# EAGLE design Blinky (EAGLE 6.6.0)
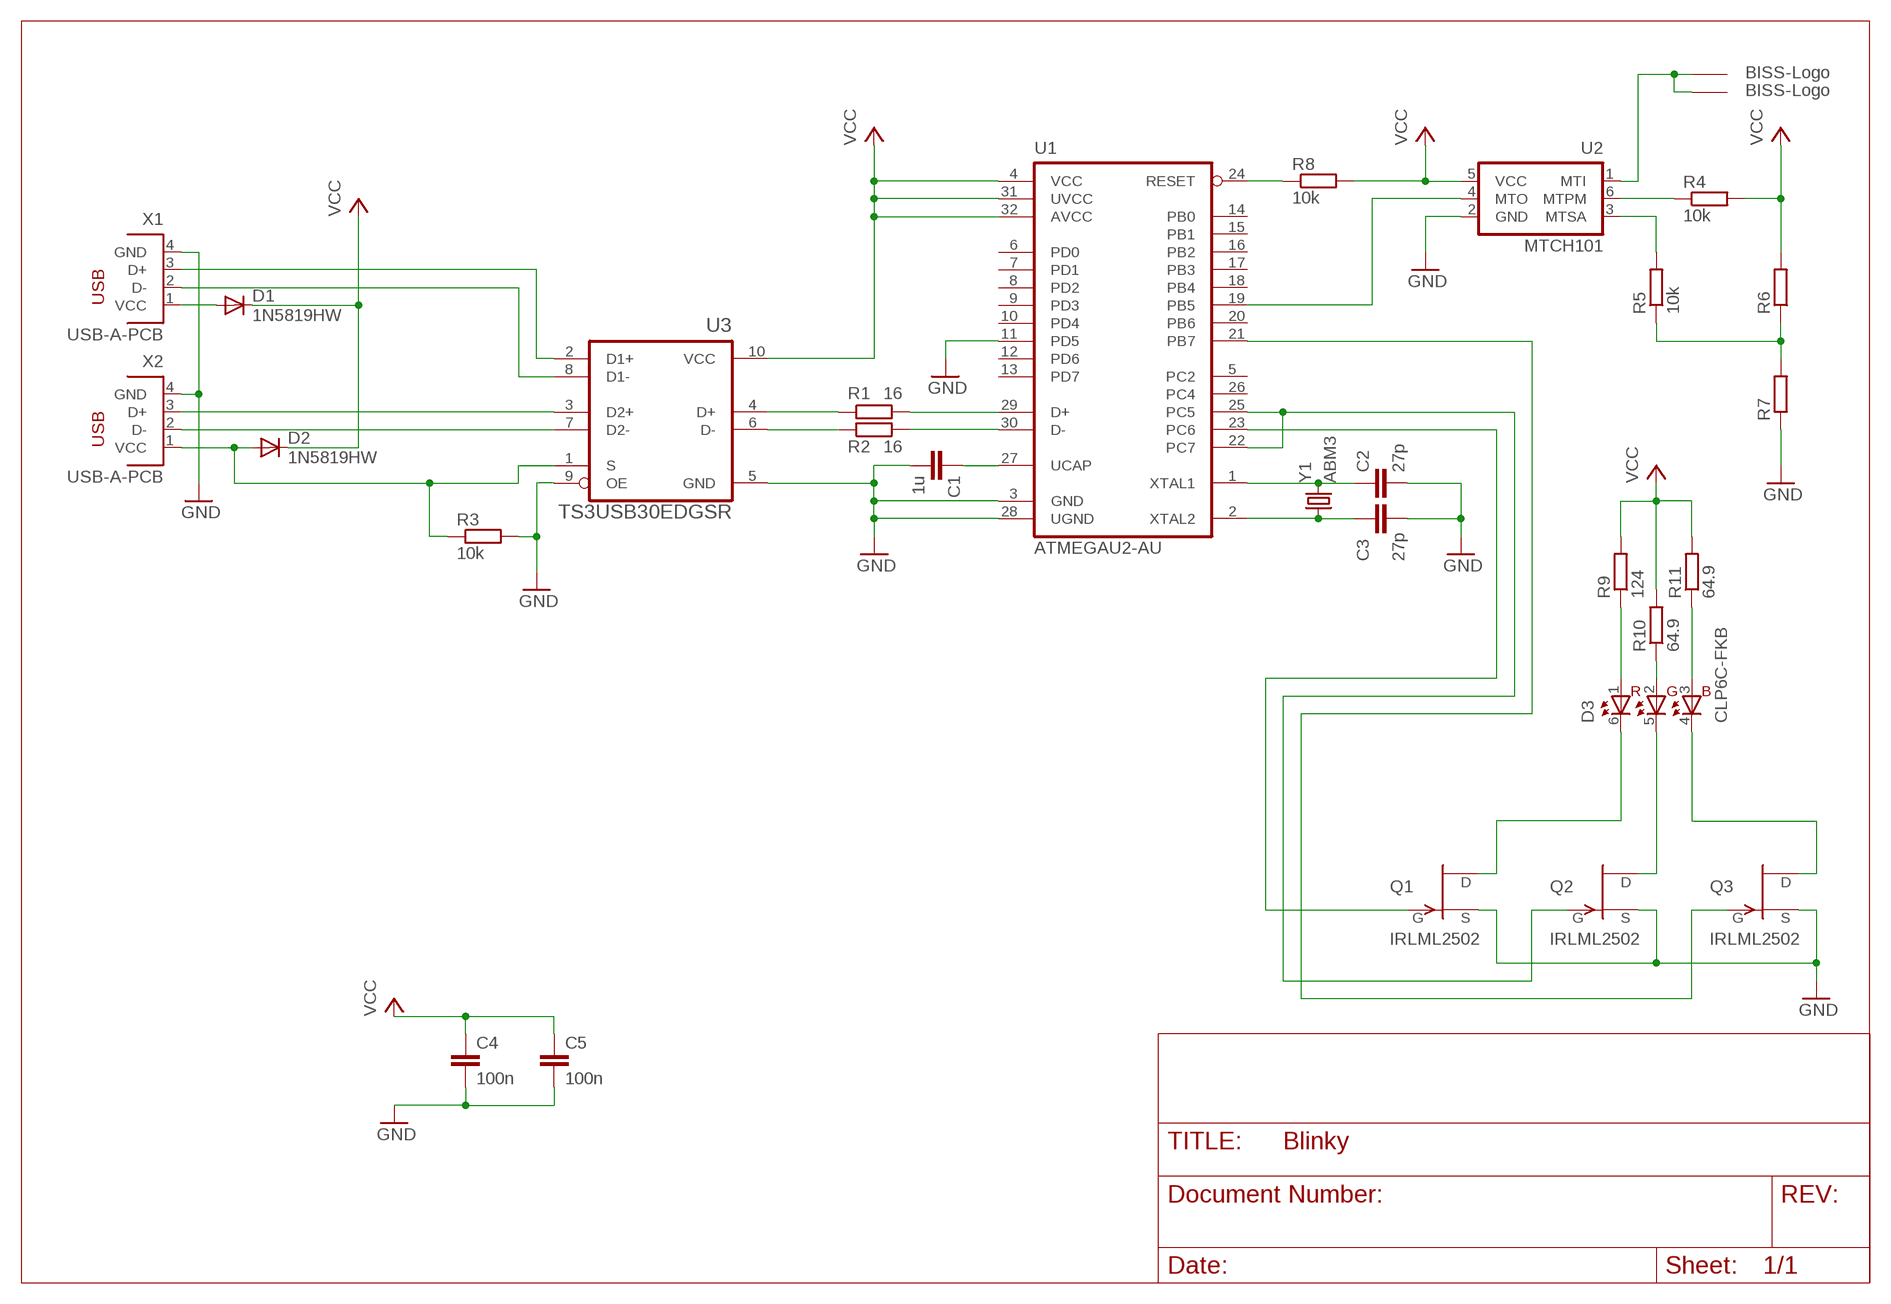
[diagram p0: schematic, sheet 1]

## Parts
C1  1u  C-EUC0805  [C0805]
C2  27p  C-EUC0805  [C0805]
C3  27p  C-EUC0805  [C0805]
C4  100n  C-EUC0805  [C0805]
C5  100n  C-EUC0805  [C0805]
D1  1N5819HW  DIODE-SOD123  [SOD123]
D2  1N5819HW  DIODE-SOD123  [SOD123]
D3  CLP6C-FKB  [PLCC-6]
Q1  IRLML2502  [SOT23]
Q2  IRLML2502  [SOT23]
Q3  IRLML2502  [SOT23]
R1  16  R-EU_R0805  [R0805]
R2  16  R-EU_R0805  [R0805]
R3  10k  R-EU_R0805  [R0805]
R4  10k  R-EU_R0805  [R0805]
R5  10k  R-EU_R0805  [R0805]
R6  R-EU_R0805  [R0805]
R7  R-EU_R0805  [R0805]
R8  10k  R-EU_R0805  [R0805]
R9  124  R-EU_R0805  [R0805]
R10  64.9  R-EU_R0805  [R0805]
R11  64.9  R-EU_R0805  [R0805]
U1  ATMEGAU2-AU  [TQFP32-08]
U2  MTCH101  [SOT23-6]
U3  TS3USB30EDGSR  [VSSOP-10]
U$1  LOGO  [LOGO]
U$2  LOGO  [LOGO]
X1  USB-A-PCB  [USB-A-PCB]
X2  USB-A-PCB  [USB-A-PCB]
Y1  ABM3  [ABM3]

## Nets
D1+: U3.2(D1+) X1.3(D+)
D1-: U3.8(D1-) X1.2(D-)
D2+: U3.3(D2+) X2.3(D+)
D2-: U3.7(D2-) X2.2(D-)
D+_CON: R1.1 U3.4(D+)
D+_MIC: R1.2 U1.29(D+)
D-_CON: R2.1 U3.6(D-)
D-_MIC: R2.2 U1.30(D-)
GND: C1.2 C2.2 C3.2 C4.2 C5.2 Q1.2(S) Q2.2(S) Q3.2(S) R3.2 R7.1 U1.3(GND) U1.11(PD5) U1.28(UGND) U2.2(GND) U3.5(GND) U3.9(OE) X1.4(GND) X2.4(GND)
GND_LED_B: D3.4 Q3.3(D)
GND_LED_G: D3.5 Q2.3(D)
GND_LED_R: D3.6 Q1.3(D)
LED_B: Q3.1(G) U1.21(PB7)
LED_G: Q2.1(G) U1.22(PC7) U1.25(PC5)
LED_R: Q1.1(G) U1.23(PC6)
N$16: R4.1 U2.6(MTPM)
N$18: R5.2 U2.3(MTSA)
N$19: R5.1 R6.1 R7.2
RESET: R8.1 U1.24(RESET)
TOUCH: U1.19(PB5) U2.4(MTO)
TOUCH_PAD: U2.1(MTI) U$1.P$1 U$2.P$1
UCAP: C1.1 U1.27(UCAP)
V_LED_B: D3.3 R11.1
V_LED_G: D3.2 R10.1
V_LED_R: D3.1 R9.1
VCC: C4.1 C5.1 D1.C D2.C R4.2 R6.2 R8.2 R9.2 R10.2 R11.2 U1.4(VCC) U1.31(UVCC) U1.32(AVCC) U2.5(VCC) U3.10(VCC)
VUSB1: D1.A X1.1(VCC)
VUSB2: D2.A R3.1 U3.1(S) X2.1(VCC)
XTAL1: C2.1 U1.1(XTAL1) Y1.2
XTAL2: C3.1 U1.2(XTAL2) Y1.1
Unconnected: U1.5(PC2) U1.6(PD0) U1.7(PD1) U1.8(PD2) U1.9(PD3) U1.10(PD4) U1.12(PD6) U1.13(PD7) U1.14(PB0) U1.15(PB1) U1.16(PB2) U1.17(PB3) U1.18(PB4) U1.20(PB6) U1.26(PC4)

## Library data of the parts
C1-C5 = rcl:C-EU: CAPACITOR, European symbol
D1 D2 = diode:DIODE-: DIODE
D3 = mibe:CLP6C: CLP6C-xxx
Q1-Q3 = mibe:IRLML2502: IRLML2502 HEXFET Power MOSFET These N-Channel MOSFETs from International Rectifier utilize advanced processing techniques to achieve extremely low on-resistance per silicon area. This benefit, combined with the fast switching speed and ruggedized device design that HEXFET power MOSFETs are well known for, provides the designer with an extremely efficient and reliable device for use in battery and load management.
R1-R11 = rcl:R-EU_: RESISTOR, European symbol
U1 = mibe:ATMEGA*U2: ATmega*U2 8-bit Microcontroller with 8/16/32K Bytes of ISP Flash and USB Controller
U2 = mibe:MTCH101: MTCH101 - Single-Channel Proximity Detector The MTCH101 provides an easy way to add proximity or touch detection to any human interface application. The device integrates a single-channel capacitive proximity detection, which can work through plastic, glass or wood-front panel. It also supports a wide range of conductive materials as sensor, like copper pad on PCB, silver or carbon printing on plastic, Indium Tin Oxide (ITO) pad, wire/cable, etc. On-board adjustable sensitivity and power mode selection allow the user to configure the device at run time easily. An active-low output will communicate the state of the sensor to a host/master MCU, or drive an indication LED.
U3 = mibe:TS3USB30E: ESD-Protected, High-Speed USB 2.0 (480-Mbps) 1:2 Multiplexer/Demultiplexer Switch With Single Enable The TS3USB30E is a high-bandwidth 1:2 switch specially designed for the switching of high-speed USB 2.0 signals in handset and consumer applications, such as cell phones, digital cameras, and notebooks with hubs or controllers with limited USB I/Os. The wide bandwidth (900 MHz) of this switch allows signals to pass with minimum edge and phase distortion. The device multiplexes differential outputs from a USB host device to one of two corresponding outputs, or from two different hosts to one corresponding output. The switch is bidirectional and offers little or no attenuation of the high-speed signals at the outputs. It is designed for low bit-to-bit skew and high channel-to-channel noise isolation, and is compatible with various standards, such as high-speed USB 2.0 (480 Mbps).
U$1 U$2 = BISS:LOGO: The BISS logo
X1 X2 = mibe:USB-A-PCB: USB A on PCB connector Thickness of PCB should be at least 2 mm for a good fit. USB 2.0 spec defines 2.235 mm (see figure 6-9 on page 99 in the spec).
Y1 = mibe:ABM3: Miniature Ceramic SMD Crystal

## Board
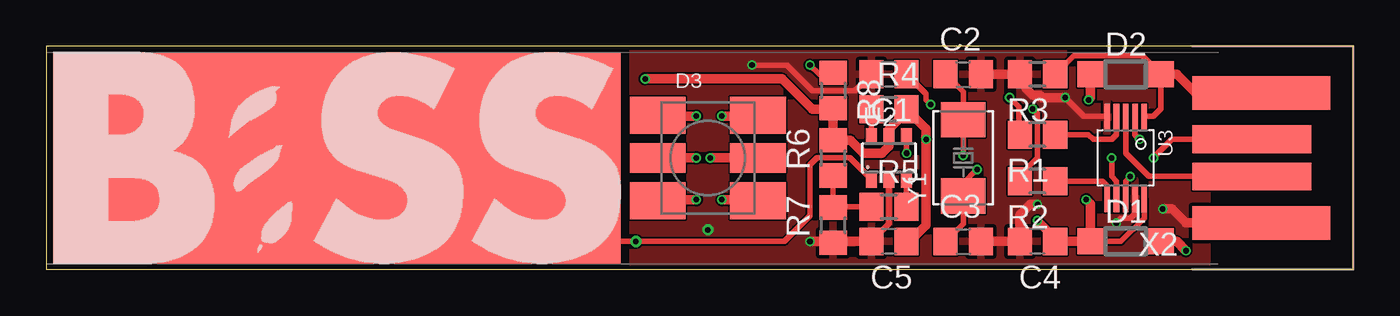
[diagram p1: board, top side]
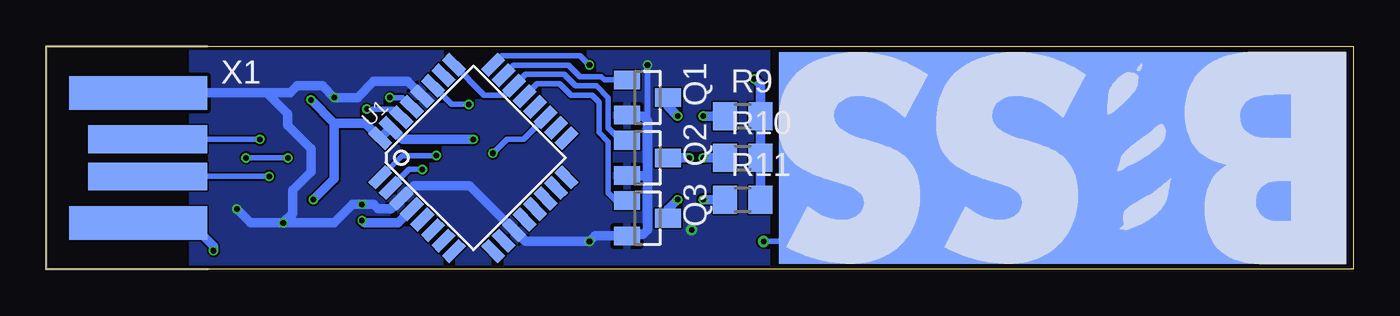
[diagram p2: board, bottom side, seen from below]

Size 70.38 x 12 mm. Coordinates in mm from the lower left corner, seen from the top.
Outline: 0,0 70.38,0 70.38,12 0,12 0,0
Copper layers (1*16): Top 0.018mm / dielectric 1.55mm / Bottom 0.018mm
Design rules "Multi-CB_2L_100µm-Tracks_OL35µm": minimum track width 0.1mm, minimum drill 0.2mm, track to track 0.1mm, track to pad 0.1mm, pad to pad 0.1mm, via to via 0.1mm, smd to smd 0mil, copper to edge 0.2mm, drill to drill 0.2mm, minimum pad ring 0.125mm, minimum via ring 0.1mm, stop-mask expansion 2mil, vias tented up to drill 0.45mm, thermal gap 0.2mm
tRestrict: area 31,9.5 to 31.4,12; area 31,0 to 31.4,1.2; area 31,1.8 to 31.4,2.9
bRestrict: area 31,0 to 31.4,1.2; area 31,1.8 to 31.4,2.9; area 31,9.1 to 31.4,12

### Footprints (pad centres in the part's own frame; a part is rotated, then mirrored left to right if it is on the bottom)
C0805 = smd 1.3 x 1.5: 1 -0.95,0; 2 0.95,0
SOD123 = smd 1.4 x 1.4: A 1.9,0; C -1.9,0
PLCC-6 = smd 3 x 2: 1 -2.7,2.3; 3 -2.7,-2.3; 4 2.7,-2.3; 6 2.7,2.3 | smd 3 x 1.6: 2 -2.7,0; 5 2.7,0
SOT23 = smd 1 x 1.4: 1 -0.95,-1.1; 2 0.95,-1.1; 3 0,1.1
R0805 = smd 1.3 x 1.5: 1 -0.95,0; 2 0.95,0
TQFP32-08 = smd 1.27 x 0.559: 1 -4.293,2.8; 2 -4.293,2; 3 -4.293,1.2; 4 -4.293,0.4; 5 -4.293,-0.4; 6 -4.293,-1.2; 7 -4.293,-2; 8 -4.293,-2.8; 17 4.293,-2.8; 18 4.293,-2; 19 4.293,-1.2; 20 4.293,-0.4; 21 4.293,0.4; 22 4.293,1.2; 23 4.293,2; 24 4.293,2.8 | smd 0.559 x 1.27: 9 -2.8,-4.293; 10 -2,-4.293; 11 -1.2,-4.293; 12 -0.4,-4.293; 13 0.4,-4.293; 14 1.2,-4.293; 15 2,-4.293; 16 2.8,-4.293; 25 2.8,4.293; 26 2,4.293; 27 1.2,4.293; 28 0.4,4.293; 29 -0.4,4.293; 30 -1.2,4.293; 31 -2,4.293; 32 -2.8,4.293
SOT23-6 = smd 0.6 x 0.9: 1 -0.95,-1.15; 2 0,-1.15; 3 0.95,-1.15; 4 0.95,1.15; 5 0,1.15; 6 -0.95,1.15
VSSOP-10 = smd 1.45 x 0.3: 1 -2.2,1; 2 -2.2,0.5; 3 -2.2,0; 4 -2.2,-0.5; 5 -2.2,-1; 6 2.2,-1; 7 2.2,-0.5; 8 2.2,0; 9 2.2,0.5; 10 2.2,1
LOGO = smd 30.558 x 11.4: P$1 15.279,-5.7
USB-A-PCB = smd 7.41 x 1.8: 1 -3.705,-3.5; 4 -3.705,3.5 | smd 6.41 x 1.5: 2 -3.205,-1; 3 -3.205,1
ABM3 = smd 1.9 x 2.4: 1 -2.05,0; 2 2.05,0

### Placement (x,y rotation side)
C1  45.38,10.5 180 top
C2  49.38,10.5 0 top
C3  49.38,1.5 0 top
C4  53.38,1.5 180 top
C5  45.38,1.5 180 top
D1  58.12,1.5 0 top
D2  58.12,10.5 0 top
D3  35.62,6 0 top
Q1  38,9.25 270 bottom
Q2  38,6 270 bottom
Q3  38,2.75 270 bottom
R1  53.38,7.25 180 top
R2  53.38,4.75 180 top
R3  53.38,10.5 180 top
R4  45.38,8.62 0 top
R5  45.38,3.38 0 top
R6  42.38,6 90 top
R7  42.38,2.38 90 top
R8  42.38,9.62 270 top
R9  32.88,8.25 0 bottom
R10  32.88,6 0 bottom
R11  32.88,3.75 0 bottom
U1  47.38,6 45 bottom
U2  45.38,6 0 top
U3  58.12,6 270 top
U$1  0.38,11.7 0 top
U$2  0.38,0.3 180 bottom
X1  61.73,6 0 bottom
X2  61.73,6 180 top
Y1  49.38,6 90 top

### Tracks (layer width: path | path; a pad name or v marks a point on that pad's centre or on a via)
D1+  (via drill 0.3)
  Top 0.3: v58.88,7 58.62,7.25 U3.2
  Bottom 0.3: v58.88,7 X1.3
D1-  (via drill 0.3)
  Top 0.3: v58.38,5 58.12,4.75 U3.8
  Bottom 0.3: X1.2 v58.38,5
D2+
  Top 0.3: X2.3 59.38,5 58.12,6.25 U3.3
D2-  (via drill 0.3)
  Top 0.3: X2.2 60.62,7 v59.62,6 | v57.38,6 57.38,5 57.62,4.75 U3.7
  Bottom 0.3: v59.62,6 v57.38,6
D+_CON
  Top 0.3: U3.4 57.62,7.25 57.38,7 56.38,7 56.12,7.25 R1.1
D+_MIC  (via drill 0.3)
  Top 0.3: 52.38,7.25 52.38,8.75 v51.88,9.25
  Top 0.5: R1.2 52.38,7.25
  Bottom 0.3: v51.88,9.25 51.19,9.25 U1.29
D-_CON
  Top 0.3: R2.1 56.88,4.75 57.12,4.5 U3.6
D-_MIC  (via drill 0.3)
  Top 0.3: R2.2 52.42,5.05 53.38,6 53.38,8.38 v53.12,8.62
  Bottom 0.3: U1.30 51.7,8.62 v53.12,8.62
GND  (via drill 0.3, 0.3 pad 0.6)
  Top 0.3: U3.9 58.62,3 58.38,2.75 57.88,2.75 v57.62,2.5 | U3.5 57.08,8.25 55.88,8.25 v54.88,9.25 | U2.2 45.38,2.45 C5.2 | 42.45,1.5 R7.1 | 50.33,10.55 C2.2 | C1.2 43.55,9.62 41.25,9.62 39.88,11 v38,11
  Top 0.5: v60.12,3.25 60.62,3.25 61.38,2.5 X2.4 | C3.2 C4.2 52.42,2.92 53,3.5 v53.38,3.5 | C2.2 R3.2 52.75,10.18 52.75,9.75 53.12,9.38 53.5,9.38 53.62,9.25 v54.88,9.25 | C5.2 42.45,1.5 | v41.12,1.5 42.3,1.5 R7.1
  Bottom 0.3: v38,11 38,8
  Bottom 0.5: X1.4 58.5,9.5 | 58.5,9.5 57.38,8.38 57.38,7.75 56.12,6.5 56.12,5.25 57.12,4.25 57.12,3 v57.62,2.5 | v57.62,2.5 54.88,2.5 53.88,3.5 v53.38,3.5 52.75,3.5 52.5,3.25 51.82,3.25 U1.3 50.57,4.5 47.57,4.5 U1.11 44.57,1.5 v41.12,1.5 40.83,1.8 Q3.2 39.02,1.88 38.25,1.88 38,2.12 38,5 | v57.62,2.5 59.38,2.5 v60.12,3.25 | 58.5,9.5 57.25,9.5 56.88,9.88 55.5,9.88 v54.88,9.25 53.62,9.25 52.75,10.12 50.93,10.12 U1.28 | 38,5 38,8 38.25,8.25 39.05,8.25 Q1.2 | Q2.2 38.05,5.05 38,5
  other vias: 35.62,2.12
  pour Top: 0,0 70.38,0 70.38,12 0,12
  pour Bottom: 0,0 70.38,0 70.38,12 0,12
GND_LED_B  (via drill 0.3)
  Top 0.5: D3.4 38.27,3.75 v36.38,3.75
  Bottom 0.5: Q3.3 36.9,3.23 v36.38,3.75
GND_LED_G  (via drill 0.3)
  Top 0.5: D3.5 v35.75,6
  Bottom 0.5: Q2.3 v35.75,6
GND_LED_R  (via drill 0.3)
  Top 0.5: D3.6 38.27,8.25 v36.38,8.25
  Bottom 0.5: Q1.3 36.9,8.78 v36.38,8.25
LED_B
  Bottom 0.3: U1.21 43.94,10 42.75,10 42.12,9.38 41,9.38 40.62,9 40.62,7.38 40.12,6.88 40.12,4.12 39.7,3.7 Q3.1
LED_G
  Bottom 0.3: U1.25 46.79,9.38 45.7,9.38 U1.22 44.57,10.5 42.5,10.5 41.88,9.88 40.75,9.88 40.12,9.25 40.12,7.62 39.45,6.95 Q2.1
LED_R
  Bottom 0.3: U1.23 45.2,11 42.25,11 41.62,10.38 40.5,10.38 40.33,10.2 Q1.1
N$16
  Top 0.3: R4.1 U2.6
N$18
  Top 0.3: U2.3 R5.2
N$19
  Top 0.3: R6.1 R7.2 42.42,3.38 R5.1
RESET  (via drill 0.3)
  Top 0.3: R8.1 42.38,10.5 41.62,10.5 v41.12,11
  Bottom 0.3: U1.24 45.84,11.5 41.62,11.5 v41.12,11
TOUCH  (via drill 0.3)
  Top 0.3: U2.4 v46.33,6.25
  Bottom 0.3: U1.19 44.68,7 45.58,7 v46.33,6.25
TOUCH_PAD  (via drill 0.3 pad 0.6)
  Top 0.3: U2.1 43.27,6 41.5,6 41.12,5.62 41.12,2.88 39.75,1.5 v31.75,1.5 15.65,1.5 U$2.P$1
  Bottom 0.3: U$2.P$1 20.15,1.5 v31.75,1.5
UCAP  (via drill 0.3)
  Top 0.3: v47.62,8.88 47.38,9.12 47.38,9.45 C1.1
  Bottom 0.3: U1.27 48.55,8.88 v47.62,8.88
V_LED_B  (via drill 0.3)
  Top 0.5: D3.3 32.98,3.75 v35,3.75
  Bottom 0.5: R11.1 v35,3.75
V_LED_G  (via drill 0.3)
  Top 0.5: D3.2 v35,6
  Bottom 0.5: R10.1 v35,6
V_LED_R  (via drill 0.3)
  Top 0.5: D3.1 32.98,8.25 v35,8.25
  Bottom 0.5: R9.1 v35,8.25
VCC  (via drill 0.3)
  Top 0.3: D1.C 57.88,1.5 59.12,2.75 U3.10
  Top 0.5: C4.1 D1.C 56.23,3.52 v56,3.75 | D2.C 56.23,9.22 v56.12,9.12 | 54.33,1.55 C4.1 | v53.38,2.62 54.33,1.68 C4.1 | C5.1 46.5,1.5 47.38,2.38 v47.38,7 47.38,7.58 R4.2 46.33,8.5 45.38,7.55 U2.5 45.38,6.62 45,6.25 44,6.25 43.3,6.95 R6.2 R8.2 42.33,8.62 41.25,8.62 39.62,10.25 v32.25,10.25
  Bottom 0.5: v56.12,9.12 54.88,7.88 | 54.88,7.88 54.88,4.88 v56,3.75 | 54.88,7.88 53.21,7.88 U1.32 U1.31 51.2,7 v47.38,7 | U1.4 51.44,2.5 53.25,2.5 v53.38,2.62 | R11.2 R10.2 R9.2 31.93,9.93 v32.25,10.25
VUSB1  (via drill 0.3)
  Top 0.5: D1.A 60.88,1.5 v61.38,1
  Bottom 0.5: v61.38,1 61.38,1.25 62.62,2.5 X1.1
VUSB2
  Top 0.3: R3.1 55.33,11.5 59.02,11.5 D2.A 60.02,8.65 59.62,8.25 59.17,8.25 U3.1
  Top 0.5: D2.A 60.88,10.5 61.88,9.5 X2.1
XTAL1  (via drill 0.3)
  Top 0.3: v49.38,6.12 Y1.2 49.38,9.55 C2.1
  Bottom 0.3: v49.38,6.12 51.21,6.12 U1.1
XTAL2  (via drill 0.3)
  Top 0.3: v50.12,5.38 49.38,4.62 Y1.1 49.38,2.45 C3.1
  Bottom 0.3: v50.12,5.38 50.83,5.38 U1.2